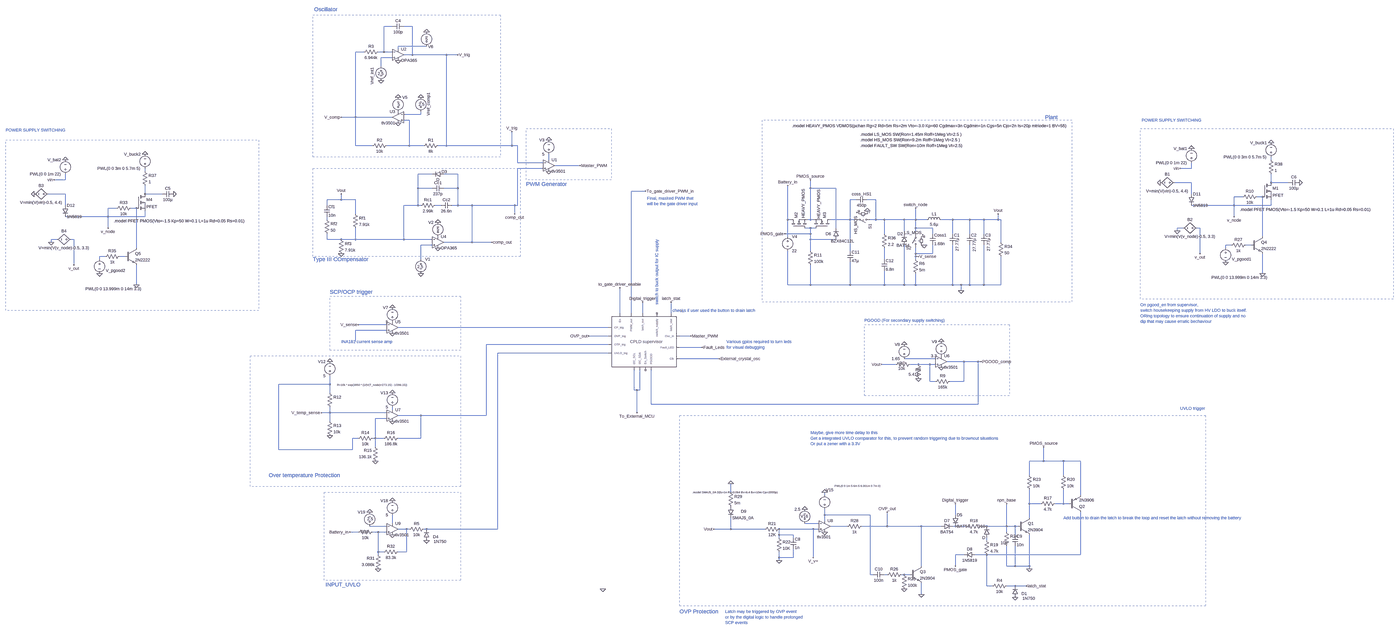
[diagram p0: schematic digital_architecture.asc, whole sheet]
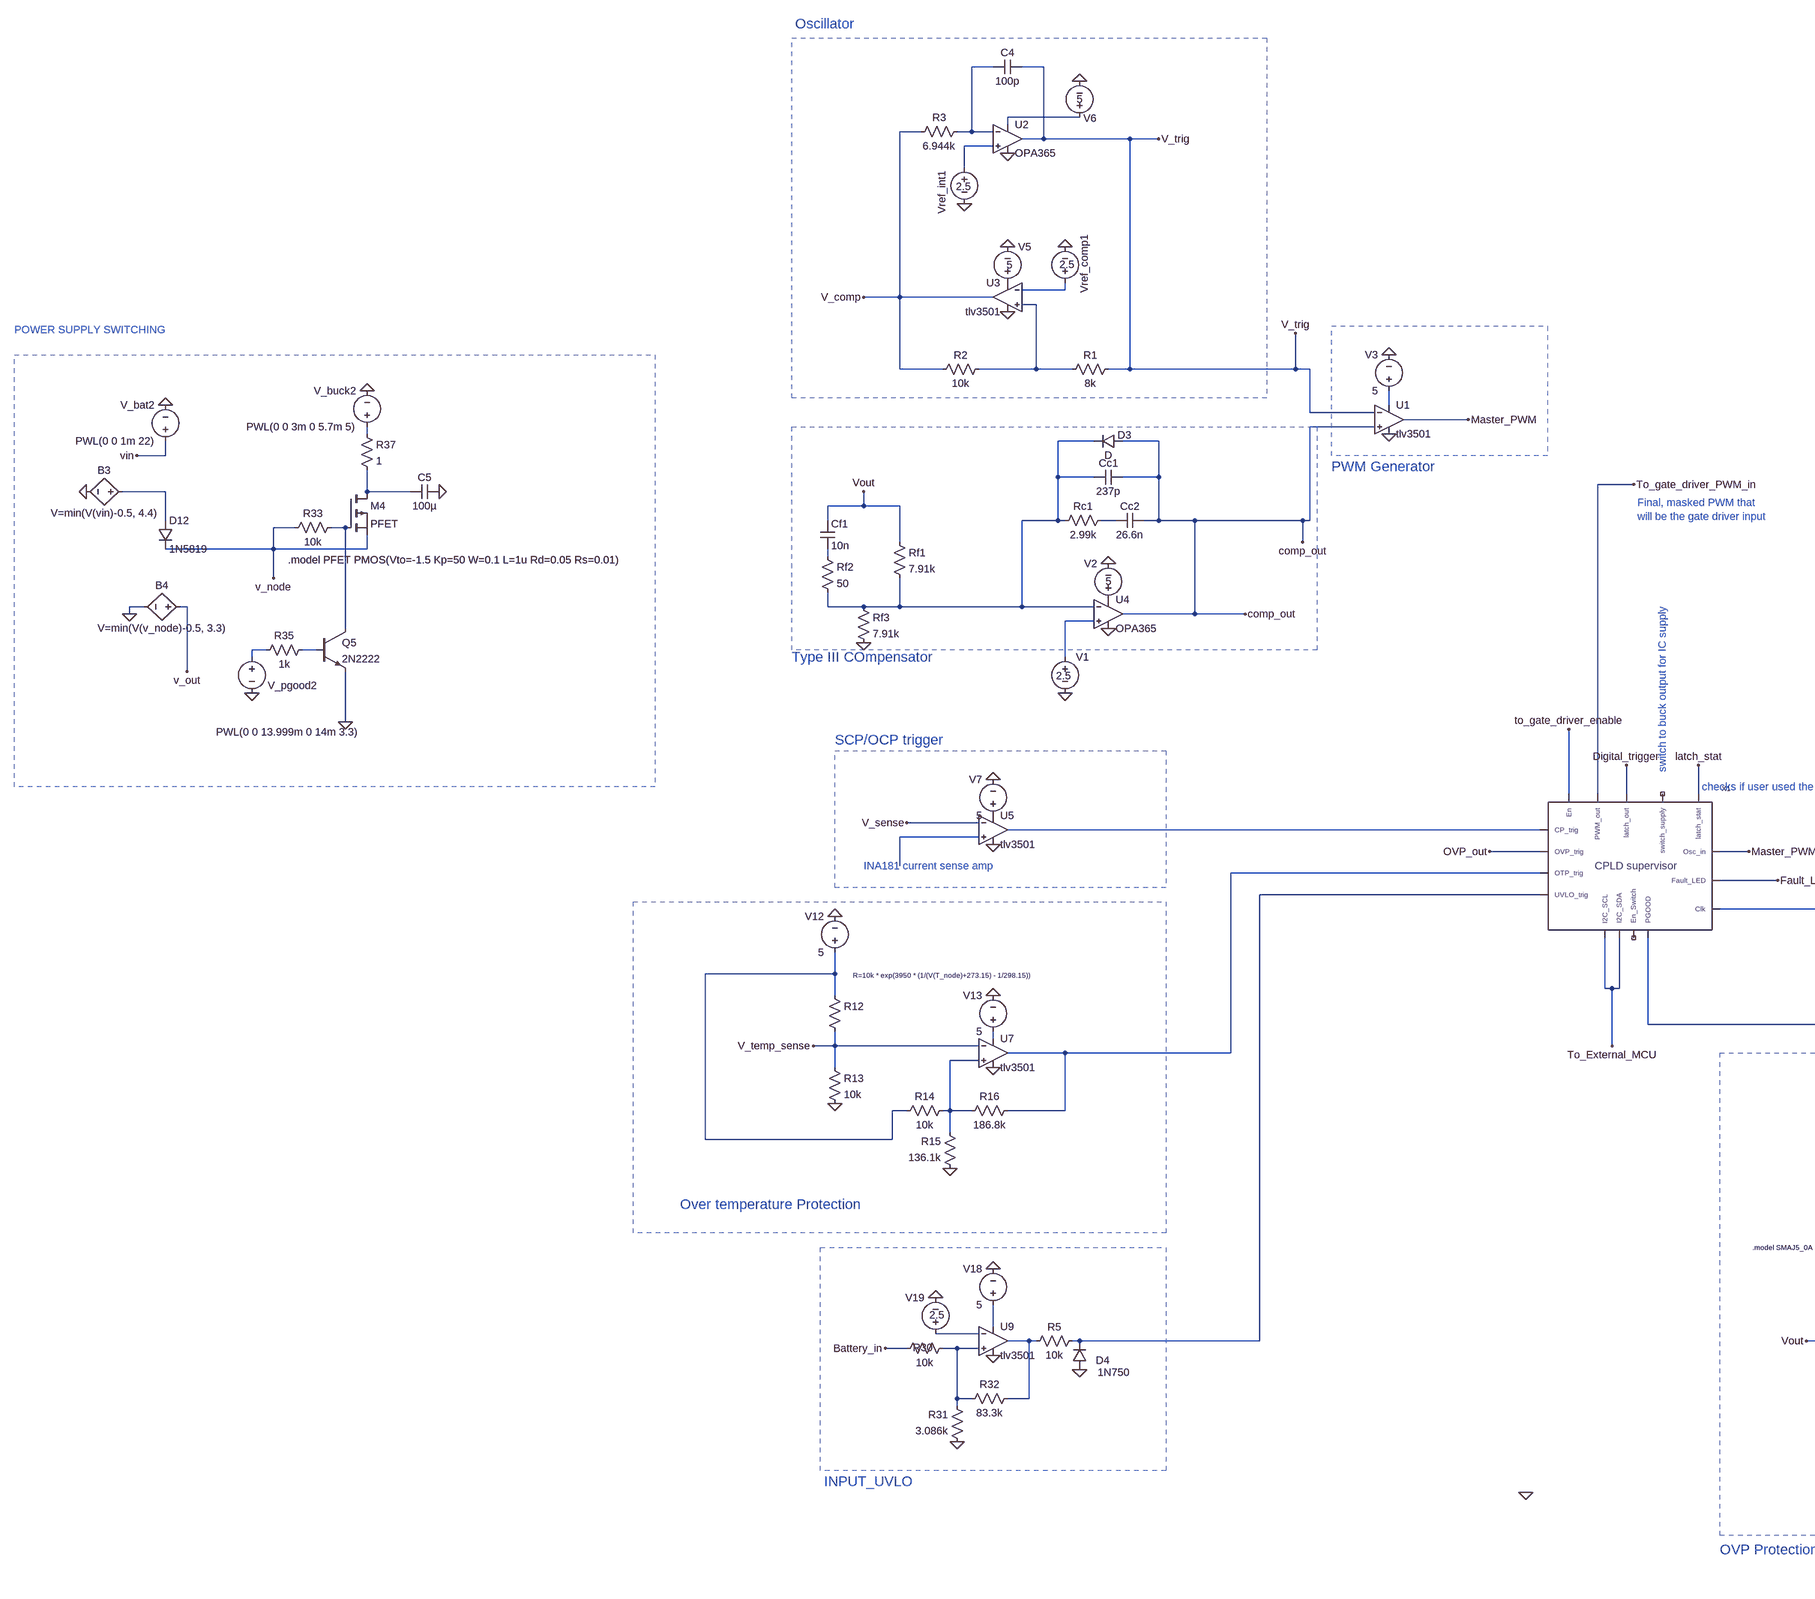
[diagram p1: schematic digital_architecture.asc, part, row 1 of 1, column 1 of 2]
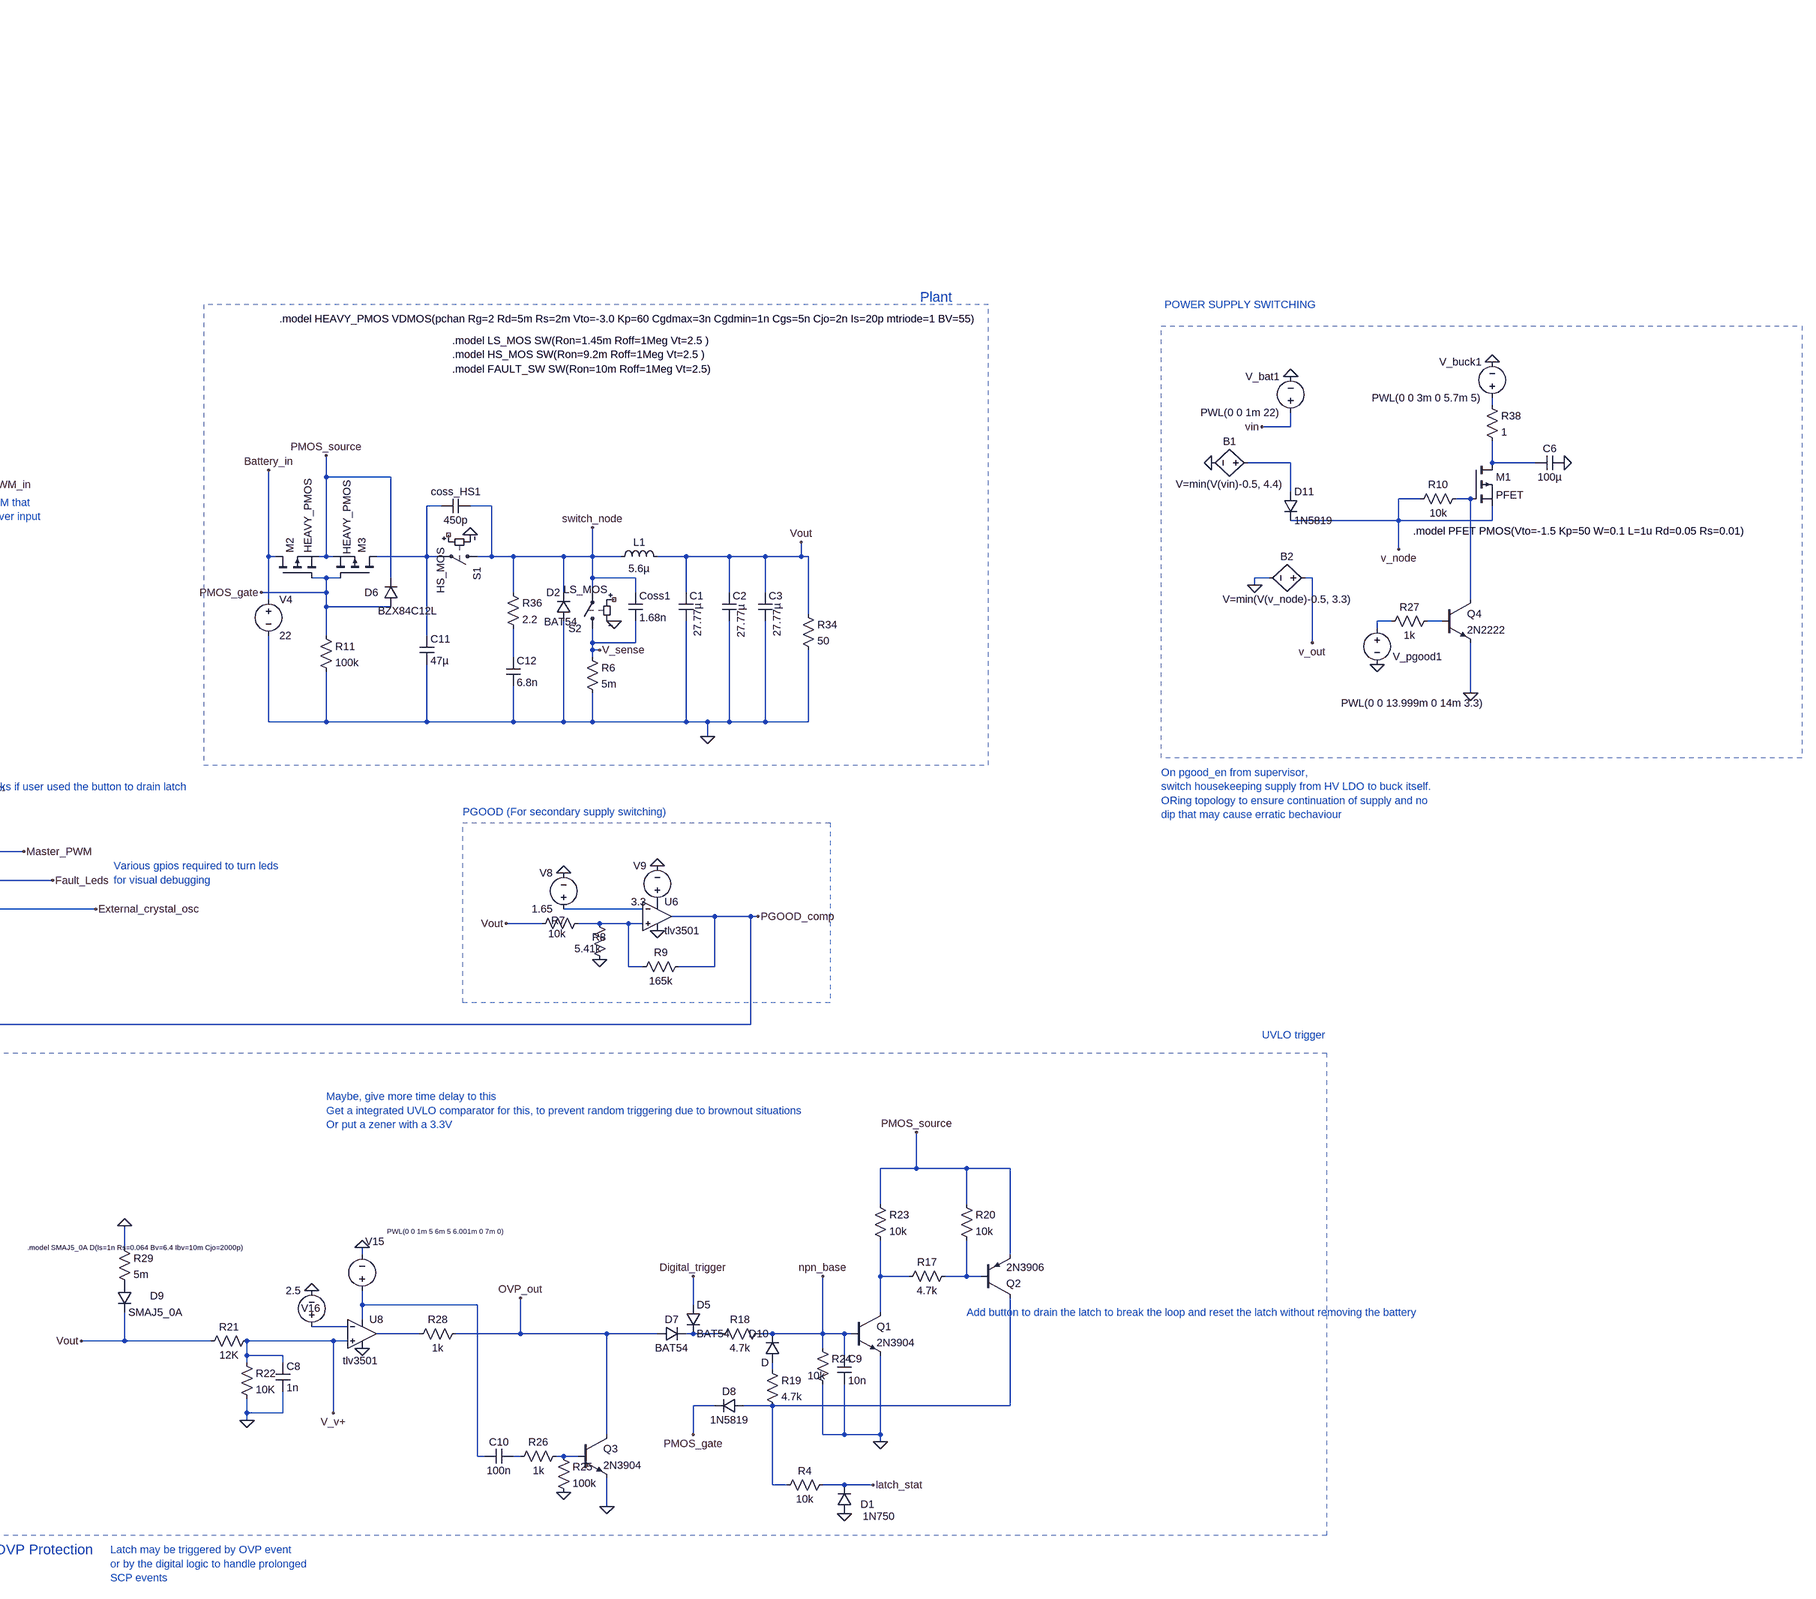
[diagram p2: schematic digital_architecture.asc, part, row 1 of 1, column 2 of 2]
digital_architecture.asc, the LTspice schematic file:
Version 4.1
SHEET 1 8948 4068
WIRE -1408 -1808 -1456 -1808
WIRE -1296 -1808 -1344 -1808
WIRE -1216 -1696 -1376 -1696
WIRE -1376 -1680 -1376 -1696
WIRE -1568 -1664 -1616 -1664
WIRE -1456 -1664 -1456 -1808
WIRE -1456 -1664 -1488 -1664
WIRE -1408 -1664 -1456 -1664
WIRE -1296 -1648 -1296 -1808
WIRE -1296 -1648 -1344 -1648
WIRE -1104 -1648 -1296 -1648
WIRE -1040 -1648 -1104 -1648
WIRE -1408 -1632 -1472 -1632
WIRE -1472 -1584 -1472 -1632
WIRE -1248 -1312 -1248 -1328
WIRE -1248 -1312 -1344 -1312
WIRE -1616 -1296 -1616 -1664
WIRE -1616 -1296 -1696 -1296
WIRE -1408 -1296 -1616 -1296
WIRE -1312 -1280 -1344 -1280
WIRE -1616 -1136 -1616 -1296
WIRE -1520 -1136 -1616 -1136
WIRE -1312 -1136 -1312 -1280
WIRE -1312 -1136 -1440 -1136
WIRE -1232 -1136 -1312 -1136
WIRE -1104 -1136 -1104 -1648
WIRE -1104 -1136 -1152 -1136
WIRE -736 -1136 -736 -1216
WIRE -736 -1136 -1104 -1136
WIRE -704 -1136 -736 -1136
WIRE -528 -1056 -528 -1088
WIRE 3536 -1056 3536 -1072
WIRE -704 -1040 -704 -1136
WIRE -560 -1040 -704 -1040
WIRE -352 -1024 -496 -1024
WIRE -560 -1008 -704 -1008
WIRE 3088 -1008 3088 -1040
WIRE 3088 -1008 3024 -1008
WIRE -2800 -992 -2800 -1008
WIRE -1184 -976 -1264 -976
WIRE -1040 -976 -1120 -976
WIRE -3248 -944 -3248 -976
WIRE -3248 -944 -3312 -944
WIRE 3088 -928 2992 -928
WIRE 3536 -928 3536 -976
WIRE 3632 -928 3536 -928
WIRE -1264 -896 -1264 -976
WIRE -1184 -896 -1264 -896
WIRE -1040 -896 -1040 -976
WIRE -1040 -896 -1120 -896
WIRE 944 -896 944 -944
WIRE 1088 -896 944 -896
WIRE 16 -880 -64 -880
WIRE -3248 -864 -3344 -864
WIRE -2800 -864 -2800 -912
WIRE -2704 -864 -2800 -864
WIRE 3088 -864 3088 -928
WIRE 3376 -848 3328 -848
WIRE 3488 -848 3456 -848
WIRE -1696 -832 -1696 -864
WIRE -1696 -832 -1776 -832
WIRE -1616 -832 -1696 -832
WIRE 1200 -832 1168 -832
WIRE 1312 -832 1264 -832
WIRE -3248 -800 -3248 -864
WIRE -1776 -800 -1776 -832
WIRE -1264 -800 -1264 -896
WIRE -1264 -800 -1344 -800
WIRE -1248 -800 -1264 -800
WIRE -1136 -800 -1168 -800
WIRE -1040 -800 -1040 -896
WIRE -1040 -800 -1072 -800
WIRE -960 -800 -1040 -800
WIRE -720 -800 -960 -800
WIRE -704 -800 -704 -1008
WIRE -704 -800 -720 -800
WIRE 3328 -800 3328 -848
WIRE 3328 -800 3088 -800
WIRE 3536 -800 3536 -832
WIRE 3536 -800 3328 -800
WIRE -2960 -784 -3008 -784
WIRE -2848 -784 -2880 -784
WIRE -1616 -752 -1616 -832
WIRE -720 -752 -720 -800
WIRE -3008 -736 -3008 -784
WIRE -3008 -736 -3248 -736
WIRE -2800 -736 -2800 -768
WIRE -2800 -736 -3008 -736
WIRE 3328 -736 3328 -800
WIRE -1776 -720 -1776 -736
WIRE 816 -720 816 -912
WIRE 832 -720 816 -720
WIRE 944 -720 944 -896
WIRE 944 -720 928 -720
WIRE 960 -720 944 -720
WIRE 1168 -720 1168 -832
WIRE 1168 -720 1056 -720
WIRE 1200 -720 1168 -720
WIRE 1312 -720 1312 -832
WIRE 1312 -720 1280 -720
WIRE 1360 -720 1312 -720
WIRE 1472 -720 1360 -720
WIRE 1536 -720 1536 -784
WIRE 1536 -720 1472 -720
WIRE 1600 -720 1536 -720
WIRE 1744 -720 1680 -720
WIRE 1840 -720 1744 -720
WIRE 1920 -720 1840 -720
WIRE 2000 -720 2000 -752
WIRE 2000 -720 1920 -720
WIRE 2016 -720 2000 -720
WIRE -3008 -672 -3008 -736
WIRE 944 -672 912 -672
WIRE 976 -672 944 -672
WIRE 1088 -672 1088 -896
WIRE 1536 -672 1536 -720
WIRE 1632 -672 1536 -672
WIRE 3040 -672 3008 -672
WIRE 3136 -672 3120 -672
WIRE 3008 -656 3008 -672
WIRE 944 -640 944 -672
WIRE 944 -640 800 -640
WIRE 1360 -640 1360 -720
WIRE 1472 -640 1472 -720
WIRE 1536 -640 1536 -672
WIRE 1632 -640 1632 -672
WIRE 1744 -640 1744 -720
WIRE 1840 -640 1840 -720
WIRE 1920 -640 1920 -720
WIRE 816 -624 816 -720
WIRE 3488 -624 3488 -848
WIRE -3296 -608 -3328 -608
WIRE -3200 -608 -3216 -608
WIRE -1776 -608 -1776 -640
WIRE -1696 -608 -1776 -608
WIRE -1616 -608 -1616 -672
WIRE -1616 -608 -1696 -608
WIRE -1344 -608 -1344 -800
WIRE -1344 -608 -1616 -608
WIRE -1184 -608 -1344 -608
WIRE 944 -608 944 -640
WIRE 1088 -608 944 -608
WIRE -3328 -592 -3328 -608
WIRE -960 -592 -960 -800
WIRE -960 -592 -1120 -592
WIRE -848 -592 -960 -592
WIRE 2016 -592 2016 -720
WIRE -1184 -576 -1248 -576
WIRE 3312 -576 3280 -576
WIRE 3424 -576 3392 -576
WIRE -2848 -560 -2848 -784
WIRE 3280 -560 3280 -576
WIRE 944 -544 944 -608
WIRE 1168 -544 1168 -720
WIRE 1536 -528 1536 -560
WIRE 1632 -528 1632 -576
WIRE 1632 -528 1536 -528
WIRE 3136 -528 3136 -672
WIRE -3024 -512 -3056 -512
WIRE -2912 -512 -2944 -512
WIRE 1536 -512 1536 -528
WIRE 1552 -512 1536 -512
WIRE -3056 -496 -3056 -512
WIRE -1248 -496 -1248 -576
WIRE 1360 -496 1360 -560
WIRE 1536 -496 1536 -512
WIRE -3200 -464 -3200 -608
WIRE 3488 -416 3488 -528
WIRE -2848 -352 -2848 -464
WIRE 816 -352 816 -544
WIRE 944 -352 944 -464
WIRE 944 -352 816 -352
WIRE 1168 -352 1168 -480
WIRE 1168 -352 944 -352
WIRE 1360 -352 1360 -432
WIRE 1360 -352 1168 -352
WIRE 1472 -352 1472 -576
WIRE 1472 -352 1360 -352
WIRE 1536 -352 1536 -416
WIRE 1536 -352 1472 -352
WIRE 1744 -352 1744 -576
WIRE 1744 -352 1536 -352
WIRE 1792 -352 1744 -352
WIRE 1840 -352 1840 -576
WIRE 1840 -352 1792 -352
WIRE 1920 -352 1920 -576
WIRE 1920 -352 1840 -352
WIRE 2016 -352 2016 -512
WIRE 2016 -352 1920 -352
WIRE 1792 -320 1792 -352
WIRE -128 -192 -128 -336
WIRE -64 -192 -64 -880
WIRE 0 -192 0 -256
WIRE 160 -192 160 -256
WIRE -1440 -128 -1600 -128
WIRE -192 -112 -1376 -112
WIRE -1440 -96 -1616 -96
WIRE -192 -64 -304 -64
WIRE 272 -64 208 -64
WIRE -1616 -32 -1616 -96
WIRE -192 -16 -880 -16
WIRE 336 0 208 0
WIRE -192 32 -816 32
WIRE 432 64 208 64
WIRE 1648 64 1472 64
WIRE 1808 80 1712 80
WIRE 1888 80 1808 80
WIRE 1904 80 1888 80
WIRE 1424 96 1344 96
WIRE 1552 96 1504 96
WIRE 1616 96 1552 96
WIRE 1648 96 1616 96
WIRE 1616 192 1616 96
WIRE 1648 192 1616 192
WIRE 1808 192 1808 80
WIRE 1808 192 1728 192
WIRE -1760 208 -1760 160
WIRE -1760 208 -2048 208
WIRE -48 240 -48 128
WIRE -32 240 -48 240
WIRE -16 240 -16 128
WIRE -16 240 -32 240
WIRE -1760 256 -1760 208
WIRE 48 320 48 128
WIRE 1888 320 1888 80
WIRE 1888 320 48 320
WIRE -1408 352 -1408 336
WIRE -1760 368 -1760 336
WIRE -1760 368 -1808 368
WIRE -1440 368 -1760 368
WIRE -32 368 -32 240
WIRE -1248 384 -1376 384
WIRE -880 384 -880 -16
WIRE -880 384 -1248 384
WIRE -1440 400 -1504 400
WIRE -1760 416 -1760 368
WIRE -1600 512 -1632 512
WIRE -1504 512 -1504 400
WIRE -1504 512 -1520 512
WIRE -1456 512 -1504 512
WIRE -1248 512 -1248 384
WIRE -1248 512 -1376 512
WIRE -1504 560 -1504 512
WIRE -2048 576 -2048 208
WIRE -1632 576 -1632 512
WIRE -1632 576 -2048 576
WIRE 2256 640 2256 560
WIRE 2256 640 2176 640
WIRE 2368 640 2256 640
WIRE 2464 640 2368 640
WIRE 2176 720 2176 640
WIRE 2368 720 2368 640
WIRE 496 816 496 768
WIRE 1024 832 1024 816
WIRE 2464 832 2464 640
WIRE 2176 880 2176 800
WIRE 2240 880 2176 880
WIRE 2368 880 2368 800
WIRE 2368 880 2320 880
WIRE 2400 880 2368 880
WIRE 1024 944 1024 912
WIRE 1280 944 1024 944
WIRE 1760 944 1760 880
WIRE 2176 960 2176 880
WIRE 1024 976 1024 944
WIRE -1408 992 -1408 944
WIRE 992 992 912 992
WIRE -1440 1008 -1536 1008
WIRE 1152 1008 1056 1008
WIRE 1376 1008 1376 928
WIRE 1376 1008 1232 1008
WIRE 1568 1008 1376 1008
WIRE 1680 1008 1568 1008
WIRE 1760 1008 1744 1008
WIRE 1824 1008 1760 1008
WIRE 1936 1008 1904 1008
WIRE 2048 1008 2048 880
WIRE 2048 1008 1936 1008
WIRE 2096 1008 2048 1008
WIRE 2112 1008 2096 1008
WIRE -1328 1024 -1376 1024
WIRE -1312 1024 -1328 1024
WIRE -1216 1024 -1232 1024
WIRE -816 1024 -816 32
WIRE -816 1024 -1216 1024
WIRE 496 1024 496 960
WIRE 496 1024 400 1024
WIRE 688 1024 496 1024
WIRE 960 1024 768 1024
WIRE 992 1024 960 1024
WIRE -1600 1040 -1648 1040
WIRE -1488 1040 -1520 1040
WIRE -1440 1040 -1488 1040
WIRE 2048 1040 2048 1008
WIRE 768 1056 768 1024
WIRE 848 1056 768 1056
WIRE 2096 1056 2096 1008
WIRE 768 1072 768 1056
WIRE 848 1072 848 1056
WIRE 1936 1088 1936 1072
WIRE -1488 1152 -1488 1040
WIRE -1456 1152 -1488 1152
WIRE -1328 1152 -1328 1024
WIRE -1328 1152 -1376 1152
WIRE -1488 1168 -1488 1152
WIRE 1808 1168 1760 1168
WIRE 1936 1168 1872 1168
WIRE 2464 1168 2464 928
WIRE 2464 1168 1936 1168
WIRE 768 1184 768 1152
WIRE 848 1184 848 1136
WIRE 848 1184 768 1184
WIRE 960 1184 960 1024
WIRE 768 1200 768 1184
WIRE 1568 1232 1568 1008
WIRE 1760 1232 1760 1168
WIRE 2048 1232 2048 1120
WIRE 2096 1232 2096 1120
WIRE 2096 1232 2048 1232
WIRE 2176 1232 2176 1056
WIRE 2176 1232 2096 1232
WIRE 2176 1248 2176 1232
WIRE 1280 1280 1280 944
WIRE 1296 1280 1280 1280
WIRE 1376 1280 1360 1280
WIRE 1472 1280 1456 1280
WIRE 1504 1280 1472 1280
WIRE 1936 1344 1936 1168
WIRE 1968 1344 1936 1344
WIRE 2096 1344 2048 1344
WIRE 2160 1344 2096 1344
WIRE 1568 1392 1568 1328
FLAG 1792 -320 0
FLAG -1696 -528 0
FLAG -1152 -704 0
FLAG -1152 -560 0
FLAG -848 -592 comp_out
FLAG 2000 -752 Vout
FLAG -528 -992 0
FLAG -720 -752 comp_out
FLAG -528 -1168 0
FLAG 1264 -768 0
FLAG -1376 -1408 0
FLAG -1216 -1776 0
FLAG -1376 -1264 0
FLAG -1248 -1408 0
FLAG -1472 -1504 0
FLAG -1040 -1648 V_trig
FLAG -1696 -1296 V_comp
FLAG -1376 -1616 0
FLAG -736 -1216 V_trig
FLAG -1696 -864 Vout
FLAG -1248 -416 0
FLAG 1584 -576 0
FLAG 1552 -512 V_sense
FLAG -1600 -128 V_sense
FLAG -352 -1024 Master_PWM
FLAG -1408 -224 0
FLAG -1408 -80 0
FLAG -224 1360 0
FLAG -1760 496 0
FLAG -1808 368 V_temp_sense
FLAG -1408 256 0
FLAG -1408 416 0
FLAG -1504 640 0
FLAG 800 -640 PMOS_gate
FLAG 944 -944 PMOS_source
FLAG 1024 816 0
FLAG 1024 1040 0
FLAG 2176 1248 0
FLAG 912 912 0
FLAG 960 1184 V_v+
FLAG 768 1200 0
FLAG 1568 1392 0
FLAG 1472 1360 0
FLAG 2048 880 npn_base
FLAG 400 1024 Vout
FLAG 2256 560 PMOS_source
FLAG 1760 1232 PMOS_gate
FLAG 496 768 0
FLAG 816 -912 Battery_in
FLAG -1408 864 0
FLAG -1408 1056 0
FLAG -1488 1248 0
FLAG -1536 928 0
FLAG 1536 -784 switch_node
FLAG 2160 1344 latch_stat
FLAG 2096 1408 0
FLAG -304 -64 OVP_out
FLAG -1760 80 0
FLAG -1648 1040 Battery_in
FLAG -1216 1088 0
FLAG -32 368 To_External_MCU
FLAG 432 64 External_crystal_osc
FLAG 272 -64 Master_PWM
FLAG 16 -880 To_gate_driver_PWM_in
FLAG 336 0 Fault_Leds
FLAG -128 -336 to_gate_driver_enable
FLAG 1760 880 Digital_trigger
FLAG 0 -256 Digital_trigger
FLAG 160 -256 latch_stat
FLAG 1376 928 OVP_out
FLAG 1472 -16 0
FLAG 1680 112 0
FLAG 1344 96 Vout
FLAG 1552 176 0
FLAG 1680 -32 0
FLAG 1904 80 PGOOD_comp
FLAG -3312 -944 vin
FLAG -3248 -1056 0
FLAG -3424 -864 0
FLAG -3056 -416 0
FLAG -2800 -1088 0
FLAG -2848 -352 0
FLAG -3008 -672 v_node
FLAG -3328 -592 0
FLAG -3200 -464 v_out
FLAG -2640 -864 0
FLAG 3024 -1008 vin
FLAG 3088 -1120 0
FLAG 2912 -928 0
FLAG 3280 -480 0
FLAG 3536 -1152 0
FLAG 3488 -416 0
FLAG 3328 -736 v_node
FLAG 3008 -656 0
FLAG 3136 -528 v_out
FLAG 3696 -928 0
SYMBOL cap 1728 -640 R0
WINDOW 3 42 24 VRight 2
SYMATTR Value 27.77µ
SYMATTR InstName C1
SYMATTR SpiceLine V=25 Rser=2.94m Lser=0.6n
SYMBOL ind 1584 -704 R270
WINDOW 0 32 56 VTop 2
WINDOW 3 5 56 VBottom 2
SYMATTR InstName L1
SYMATTR Value 5.6µ
SYMATTR SpiceLine Rser=1m
SYMBOL voltage -1248 -512 R0
WINDOW 123 0 0 Left 0
WINDOW 39 0 0 Left 0
WINDOW 3 -20 57 Left 2
SYMATTR Value 2.5
SYMATTR InstName V1
SYMBOL res -1632 -768 R0
SYMATTR InstName Rf1
SYMATTR Value 7.91k
SYMBOL res -1792 -736 R0
SYMATTR InstName Rf2
SYMATTR Value 50
SYMBOL cap -1792 -800 R0
SYMATTR InstName Cf1
SYMATTR Value 10n
SYMBOL res -1152 -816 R90
WINDOW 0 0 56 VBottom 2
WINDOW 3 32 56 VTop 2
SYMATTR InstName Rc1
SYMATTR Value 2.99k
SYMBOL cap -1120 -912 R90
WINDOW 0 0 32 VBottom 2
WINDOW 3 32 32 VTop 2
SYMATTR InstName Cc1
SYMATTR Value 237p
SYMBOL res -1712 -624 R0
SYMATTR InstName Rf3
SYMATTR Value 7.91k
SYMBOL voltage -1152 -608 R180
WINDOW 0 24 96 Left 2
WINDOW 3 -7 57 Left 2
WINDOW 123 0 0 Left 0
WINDOW 39 0 0 Left 0
SYMATTR InstName V2
SYMATTR Value 5
SYMBOL cap -1072 -816 R90
WINDOW 0 0 32 VBottom 2
WINDOW 3 32 32 VTop 2
SYMATTR InstName Cc2
SYMATTR Value 26.6n
SYMBOL cap 1824 -640 R0
WINDOW 3 43 26 VRight 2
SYMATTR Value 27.77µ
SYMATTR InstName C2
SYMATTR SpiceLine V=25 Rser=2.94m Lser=0.6n
SYMBOL cap 1904 -640 R0
WINDOW 3 43 24 VRight 2
SYMATTR Value 27.77µ
SYMATTR InstName C3
SYMATTR SpiceLine V=25 Rser=2.94m Lser=0.6n
SYMBOL OpAmps\\opamp2 -528 -1088 R0
SYMATTR InstName U1
SYMATTR Value tlv3501
SYMBOL voltage -528 -1072 R180
WINDOW 0 24 96 Left 2
WINDOW 3 24 16 Left 2
WINDOW 123 0 0 Left 0
WINDOW 39 0 0 Left 0
SYMATTR InstName V3
SYMATTR Value 5
SYMBOL sw 1296 -720 R90
WINDOW 3 -19 97 Left 2
SYMATTR Value HS_MOS
SYMATTR InstName S1
SYMBOL voltage 816 -640 R0
SYMATTR InstName V4
SYMATTR Value 22
SYMBOL voltage -1376 -1312 M180
WINDOW 0 24 96 Left 2
WINDOW 3 -2 56 Left 2
WINDOW 123 0 0 Left 0
WINDOW 39 0 0 Left 0
SYMATTR InstName V5
SYMATTR Value 5
SYMBOL voltage -1216 -1680 R180
WINDOW 0 -38 14 Left 2
WINDOW 3 -7 56 Left 2
WINDOW 123 0 0 Left 0
WINDOW 39 0 0 Left 0
SYMATTR InstName V6
SYMATTR Value 5
SYMBOL res -1136 -1152 R90
WINDOW 0 0 56 VBottom 2
WINDOW 3 32 56 VTop 2
SYMATTR InstName R1
SYMATTR Value 8k
SYMBOL res -1424 -1152 R90
WINDOW 0 0 56 VBottom 2
WINDOW 3 32 56 VTop 2
SYMATTR InstName R2
SYMATTR Value 10k
SYMBOL res -1472 -1680 R90
WINDOW 0 0 56 VBottom 2
WINDOW 3 32 56 VTop 2
SYMATTR InstName R3
SYMATTR Value 6.944k
SYMBOL cap -1344 -1824 R90
WINDOW 0 0 32 VBottom 2
WINDOW 3 32 32 VTop 2
SYMATTR InstName C4
SYMATTR Value 100p
SYMBOL voltage -1248 -1312 R180
WINDOW 0 -43 -7 VRight 2
WINDOW 3 -21 57 Left 2
WINDOW 123 0 0 Left 0
WINDOW 39 0 0 Left 0
SYMATTR InstName Vref_comp1
SYMATTR Value 2.5
SYMBOL voltage -1472 -1600 R0
WINDOW 0 -50 22 VRight 2
WINDOW 3 -19 58 Left 2
WINDOW 123 0 0 Left 0
WINDOW 39 0 0 Left 0
SYMATTR InstName Vref_int1
SYMATTR Value 2.5
SYMBOL OpAmps\\opamp2 -1376 -1712 R0
SYMATTR InstName U2
SYMATTR Value OPA365
SYMBOL OpAmps\\opamp2 -1376 -1360 M0
SYMATTR InstName U3
SYMATTR Value tlv3501
SYMBOL OpAmps\\opamp2 -1152 -656 R0
SYMATTR InstName U4
SYMATTR Value OPA365
SYMBOL sw 1536 -544 R180
WINDOW 3 -33 102 Left 2
SYMATTR Value LS_MOS
SYMATTR InstName S2
SYMBOL diode 1488 -576 R180
WINDOW 0 24 64 Left 2
WINDOW 3 -14 -1 Left 2
SYMATTR InstName D2
SYMATTR Value BAT54
SYMBOL diode -1120 -992 R90
WINDOW 0 18 -4 VBottom 2
WINDOW 3 32 32 VTop 2
SYMATTR InstName D3
SYMBOL res 1520 -512 R0
SYMATTR InstName R6
SYMATTR Value 5m
SYMBOL OpAmps\\opamp2 -1408 -176 R0
SYMATTR InstName U5
SYMATTR Value tlv3501
SYMBOL voltage -1408 -128 R180
WINDOW 0 24 96 Left 2
WINDOW 3 24 16 Left 2
WINDOW 123 0 0 Left 0
WINDOW 39 0 0 Left 0
SYMATTR InstName V7
SYMATTR Value 5
SYMBOL pmos 832 -672 R270
SYMATTR InstName M2
SYMATTR Value HEAVY_PMOS
SYMBOL res 928 -560 R0
SYMATTR InstName R11
SYMATTR Value 100k
SYMBOL diode 1104 -608 R180
WINDOW 0 44 32 Left 2
WINDOW 3 -87 -9 Left 2
SYMATTR InstName D6
SYMATTR Value BZX84C12L
SYMBOL res -1776 240 R0
WINDOW 3 56 -29 Left 1
SYMATTR Value R=10k * exp(3950 * (1/(V(T_node)+273.15) - 1/298.15))
SYMATTR InstName R12
SYMBOL res -1776 400 R0
SYMATTR InstName R13
SYMATTR Value 10k
SYMBOL voltage -1760 176 R180
WINDOW 0 24 96 Left 2
WINDOW 3 24 16 Left 2
WINDOW 123 0 0 Left 0
WINDOW 39 0 0 Left 0
SYMATTR InstName V12
SYMATTR Value 5
SYMBOL OpAmps\\opamp2 -1408 320 R0
SYMATTR InstName U7
SYMATTR Value tlv3501
SYMBOL voltage -1408 352 R180
WINDOW 0 24 96 Left 2
WINDOW 3 24 16 Left 2
WINDOW 123 0 0 Left 0
WINDOW 39 0 0 Left 0
SYMATTR InstName V13
SYMATTR Value 5
SYMBOL res -1504 496 R90
WINDOW 0 0 56 VBottom 2
WINDOW 3 32 56 VTop 2
SYMATTR InstName R14
SYMATTR Value 10k
SYMBOL res -1488 656 R180
WINDOW 0 36 76 Left 2
WINDOW 3 36 40 Left 2
SYMATTR InstName R15
SYMATTR Value 136.1k
SYMBOL res -1360 496 R90
WINDOW 0 0 56 VBottom 2
WINDOW 3 32 56 VTop 2
SYMATTR InstName R16
SYMATTR Value 186.8k
SYMBOL OpAmps\\opamp2 1024 944 R0
WINDOW 3 -43 124 Left 2
SYMATTR Value tlv3501
SYMATTR InstName U8
SYMBOL voltage 1024 928 R180
WINDOW 0 -50 125 Left 2
WINDOW 3 -317 148 Left 1
SYMATTR InstName V15
SYMATTR Value PWL(0 0 1m 5 6m 5 6.001m 0 7m 0)
SYMBOL voltage 912 1008 R180
WINDOW 0 -19 57 Left 2
WINDOW 123 0 0 Left 0
WINDOW 39 0 0 Left 0
SYMATTR InstName V16
SYMATTR Value 2.5
SYMBOL npn 2112 960 R0
SYMATTR InstName Q1
SYMATTR Value 2N3904
SYMBOL pnp 2400 928 M180
SYMATTR InstName Q2
SYMATTR Value 2N3906
SYMBOL res 2336 864 R90
WINDOW 0 0 56 VBottom 2
WINDOW 3 32 56 VTop 2
SYMATTR InstName R17
SYMATTR Value 4.7k
SYMBOL res 1920 992 R90
WINDOW 0 0 56 VBottom 2
WINDOW 3 32 56 VTop 2
SYMATTR InstName R18
SYMATTR Value 4.7k
SYMBOL diode 1680 1024 R270
WINDOW 0 32 32 VTop 2
WINDOW 3 0 32 VBottom 2
SYMATTR InstName D7
SYMATTR Value BAT54
SYMBOL res 1920 1072 R0
SYMATTR InstName R19
SYMATTR Value 4.7k
SYMBOL diode 1872 1152 R90
WINDOW 0 0 32 VBottom 2
WINDOW 3 32 32 VTop 2
SYMATTR InstName D8
SYMATTR Value 1N5819
SYMBOL res 2352 704 R0
SYMATTR InstName R20
SYMATTR Value 10k
SYMBOL diode 480 896 R0
WINDOW 0 73 28 Left 2
SYMATTR InstName D9
SYMATTR Value SMAJ5_0A
SYMBOL res 784 1008 R90
WINDOW 0 0 56 VBottom 2
WINDOW 3 32 56 VTop 2
SYMATTR InstName R21
SYMATTR Value 12K
SYMBOL res 752 1056 R0
SYMATTR InstName R22
SYMATTR Value 10K
SYMBOL cap 832 1072 R0
SYMATTR InstName C8
SYMATTR Value 1n
SYMBOL cap 2080 1056 R0
SYMATTR InstName C9
SYMATTR Value 10n
SYMBOL res 2160 704 R0
SYMATTR InstName R23
SYMATTR Value 10k
SYMBOL diode 1952 1072 R180
WINDOW 0 24 64 Left 2
WINDOW 3 24 0 Left 2
SYMATTR InstName D10
SYMBOL res 2032 1024 R0
WINDOW 3 -18 77 Left 2
SYMATTR Value 10k
SYMATTR InstName R24
SYMBOL npn 1504 1232 R0
SYMATTR InstName Q3
SYMATTR Value 2N3904
SYMBOL cap 1360 1264 R90
WINDOW 0 0 32 VBottom 2
WINDOW 3 32 32 VTop 2
SYMATTR InstName C10
SYMATTR Value 100n
SYMATTR SpiceLine Rser=0.1
SYMBOL res 1456 1264 R0
SYMATTR InstName R25
SYMATTR Value 100k
SYMBOL res 1472 1264 R90
WINDOW 0 0 56 VBottom 2
WINDOW 3 32 56 VTop 2
SYMATTR InstName R26
SYMATTR Value 1k
SYMBOL res 1248 992 R90
WINDOW 0 0 56 VBottom 2
WINDOW 3 32 56 VTop 2
SYMATTR InstName R28
SYMATTR Value 1k
SYMBOL pmos 1056 -672 M270
WINDOW 3 53 65 Left 2
SYMATTR Value HEAVY_PMOS
SYMATTR InstName M3
SYMBOL res 480 800 R0
SYMATTR InstName R29
SYMATTR Value 5m
SYMBOL cap 1152 -544 R0
SYMATTR InstName C11
SYMATTR Value 47µ
SYMATTR SpiceLine Rser=0.05
SYMBOL OpAmps\\opamp2 -1408 960 R0
SYMATTR InstName U9
SYMATTR Value tlv3501
SYMBOL voltage -1408 960 R180
WINDOW 0 24 96 Left 2
WINDOW 3 24 16 Left 2
WINDOW 123 0 0 Left 0
WINDOW 39 0 0 Left 0
SYMATTR InstName V18
SYMATTR Value 5
SYMBOL res -1504 1024 R90
WINDOW 0 30 60 VBottom 2
WINDOW 3 32 56 VTop 2
SYMATTR InstName R30
SYMATTR Value 10k
SYMBOL res -1472 1264 R180
WINDOW 0 36 76 Left 2
WINDOW 3 36 40 Left 2
SYMATTR InstName R31
SYMATTR Value 3.086k
SYMBOL res -1472 1168 R270
WINDOW 0 32 56 VTop 2
WINDOW 3 0 56 VBottom 2
SYMATTR InstName R32
SYMATTR Value 83.3k
SYMBOL voltage -1536 1024 R180
WINDOW 0 24 96 Left 2
WINDOW 3 -20 58 Left 2
WINDOW 123 0 0 Left 0
WINDOW 39 0 0 Left 0
SYMATTR InstName V19
SYMATTR Value 2.5
SYMBOL res 2000 -608 R0
SYMATTR InstName R34
SYMATTR Value 50
SYMBOL cap 1616 -640 R0
SYMATTR InstName Coss1
SYMATTR Value 1.68n
SYMBOL cap 1264 -848 R90
WINDOW 0 0 32 VBottom 2
WINDOW 3 32 32 VTop 2
SYMATTR InstName coss_HS1
SYMATTR Value 450p
SYMBOL cap 1344 -496 R0
SYMATTR InstName C12
SYMATTR Value 6.8n
SYMBOL res 1344 -656 R0
SYMATTR InstName R36
SYMATTR Value 2.2
SYMBOL CPLD_super 48 -16 R0
SYMATTR InstName X1
SYMBOL res 2064 1328 R90
WINDOW 0 0 56 VBottom 2
WINDOW 3 32 56 VTop 2
SYMATTR InstName R4
SYMATTR Value 10k
SYMBOL diode 2112 1408 R180
WINDOW 0 -51 21 Left 2
WINDOW 3 -96 -6 Left 2
SYMATTR InstName D1
SYMATTR Value 1N750
SYMBOL diode -1200 1088 R180
WINDOW 0 -51 21 Left 2
WINDOW 3 -96 -6 Left 2
SYMATTR InstName D4
SYMATTR Value 1N750
SYMBOL res -1216 1008 R90
WINDOW 0 0 56 VBottom 2
WINDOW 3 32 56 VTop 2
SYMATTR InstName R5
SYMATTR Value 10k
SYMBOL diode 1744 944 R0
SYMATTR InstName D5
SYMATTR Value BAT54
SYMBOL OpAmps\\opamp2 1680 16 R0
SYMATTR InstName U6
SYMATTR Value tlv3501
SYMBOL voltage 1472 80 R180
WINDOW 0 24 96 Left 2
WINDOW 3 24 16 Left 2
WINDOW 123 0 0 Left 0
WINDOW 39 0 0 Left 0
SYMATTR InstName V8
SYMATTR Value 1.65
SYMBOL res 1520 80 R90
WINDOW 0 25 60 VBottom 2
WINDOW 3 23 63 VTop 2
SYMATTR InstName R7
SYMATTR Value 10k
SYMBOL res 1568 192 R180
WINDOW 0 2 66 Left 2
WINDOW 3 13 40 Left 2
SYMATTR InstName R8
SYMATTR Value 5.41k
SYMBOL res 1744 176 R90
WINDOW 0 0 56 VBottom 2
WINDOW 3 32 56 VTop 2
SYMATTR InstName R9
SYMATTR Value 165k
SYMBOL voltage 1680 64 R180
WINDOW 0 24 96 Left 2
WINDOW 3 24 16 Left 2
WINDOW 123 0 0 Left 0
WINDOW 39 0 0 Left 0
SYMATTR InstName V9
SYMATTR Value 3.3
SYMBOL pmos -2848 -864 R0
SYMATTR InstName M4
SYMATTR Value PFET
SYMBOL diode -3264 -800 R0
SYMATTR InstName D12
SYMATTR Value 1N5819
SYMBOL voltage -3248 -960 R180
WINDOW 0 24 96 Left 2
WINDOW 3 24 16 Left 2
WINDOW 123 0 0 Left 0
WINDOW 39 0 0 Left 0
SYMATTR InstName V_bat2
SYMATTR Value PWL(0 0 1m 22)
SYMBOL voltage -2800 -992 R180
WINDOW 0 24 96 Left 2
WINDOW 3 24 16 Left 2
WINDOW 123 0 0 Left 0
WINDOW 39 0 0 Left 0
SYMATTR InstName V_buck2
SYMATTR Value PWL(0 0 3m 0 5.7m 5)
SYMBOL voltage -3056 -512 R0
WINDOW 0 35 79 Left 2
WINDOW 3 -80 182 Left 2
WINDOW 123 0 0 Left 0
WINDOW 39 0 0 Left 0
SYMATTR InstName V_pgood2
SYMATTR Value PWL(0 0 13.999m 0 14m 3.3)
SYMBOL bv -3328 -864 R90
WINDOW 0 -32 56 VBottom 2
WINDOW 3 32 56 VTop 2
SYMATTR InstName B3
SYMATTR Value V=min(V(vin)-0.5, 4.4)
SYMBOL res -2864 -800 R90
WINDOW 0 0 56 VBottom 2
WINDOW 3 32 56 VTop 2
SYMATTR InstName R33
SYMATTR Value 10k
SYMBOL npn -2912 -560 R0
SYMATTR InstName Q5
SYMATTR Value 2N2222
SYMBOL res -2928 -528 R90
WINDOW 0 0 56 VBottom 2
WINDOW 3 32 56 VTop 2
SYMATTR InstName R35
SYMATTR Value 1k
SYMBOL bv -3200 -608 R90
WINDOW 0 -32 56 VBottom 2
WINDOW 3 32 56 VTop 2
SYMATTR InstName B4
SYMATTR Value V=min(V(v_node)-0.5, 3.3)
SYMBOL res -2816 -1008 R0
SYMATTR InstName R37
SYMATTR Value 1
SYMBOL cap -2640 -880 R90
WINDOW 0 0 32 VBottom 2
WINDOW 3 32 32 VTop 2
SYMATTR InstName C5
SYMATTR Value 100µ
SYMBOL pmos 3488 -928 R0
SYMATTR InstName M1
SYMATTR Value PFET
SYMBOL diode 3072 -864 R0
SYMATTR InstName D11
SYMATTR Value 1N5819
SYMBOL voltage 3088 -1024 R180
WINDOW 0 24 96 Left 2
WINDOW 3 24 16 Left 2
WINDOW 123 0 0 Left 0
WINDOW 39 0 0 Left 0
SYMATTR InstName V_bat1
SYMATTR Value PWL(0 0 1m 22)
SYMBOL voltage 3536 -1056 R180
WINDOW 0 24 96 Left 2
WINDOW 3 24 16 Left 2
WINDOW 123 0 0 Left 0
WINDOW 39 0 0 Left 0
SYMATTR InstName V_buck1
SYMATTR Value PWL(0 0 3m 0 5.7m 5)
SYMBOL voltage 3280 -576 R0
WINDOW 0 35 79 Left 2
WINDOW 3 -80 182 Left 2
WINDOW 123 0 0 Left 0
WINDOW 39 0 0 Left 0
SYMATTR InstName V_pgood1
SYMATTR Value PWL(0 0 13.999m 0 14m 3.3)
SYMBOL bv 3008 -928 R90
WINDOW 0 -32 56 VBottom 2
WINDOW 3 32 56 VTop 2
SYMATTR InstName B1
SYMATTR Value V=min(V(vin)-0.5, 4.4)
SYMBOL res 3472 -864 R90
WINDOW 0 0 56 VBottom 2
WINDOW 3 32 56 VTop 2
SYMATTR InstName R10
SYMATTR Value 10k
SYMBOL npn 3424 -624 R0
SYMATTR InstName Q4
SYMATTR Value 2N2222
SYMBOL res 3408 -592 R90
WINDOW 0 0 56 VBottom 2
WINDOW 3 32 56 VTop 2
SYMATTR InstName R27
SYMATTR Value 1k
SYMBOL bv 3136 -672 R90
WINDOW 0 -32 56 VBottom 2
WINDOW 3 32 56 VTop 2
SYMATTR InstName B2
SYMATTR Value V=min(V(v_node)-0.5, 3.3)
SYMBOL res 3520 -1072 R0
SYMATTR InstName R38
SYMATTR Value 1
SYMBOL cap 3696 -944 R90
WINDOW 0 0 32 VBottom 2
WINDOW 3 32 32 VTop 2
SYMATTR InstName C6
SYMATTR Value 100µ
TEXT 1224 -1136 Left 2 !.model FAULT_SW SW(Ron=10m Roff=1Meg Vt=2.5)
TEXT 280 816 Left 1 !.model SMAJ5_0A D(Is=1n Rs=0.064 Bv=6.4 Ibv=10m Cjo=2000p)
TEXT 2368 960 Left 2 ;Add button to drain the latch to break the loop and reset the latch without removing the battery
TEXT 944 512 Left 2 ;Get a integrated UVLO comparator for this, to prevent random triggering due to brownout situations\nOr put a zener with a 3.3V
TEXT 840 -1248 Left 2 !.model HEAVY_PMOS VDMOS(pchan Rg=2 Rd=5m Rs=2m Vto=-3.0 Kp=60 Cgdmax=3n Cgdmin=1n Cgs=5n Cjo=2n Is=20p mtriode=1 BV=55)
TEXT 944 480 Left 2 ;Maybe, give more time delay to this
TEXT 1224 -1200 Left 2 !.model LS_MOS SW(Ron=1.45m Roff=1Meg Vt=2.5 )\n.model HS_MOS SW(Ron=9.2m Roff=1Meg Vt=2.5 )
TEXT -1760 -312 Left 3 ;SCP/OCP trigger
TEXT -1856 -496 Left 3 ;Type III COmpensator
TEXT -1848 -1904 Left 3 ;Oscillator
TEXT -656 -920 Left 3 ;PWM Generator
TEXT -2104 720 Left 3 ;Over temperature Protection
TEXT 208 1488 Left 3 ;OVP Protection
TEXT 3024 344 Left 2 ;UVLO trigger
TEXT 2264 -1296 Left 3 ;Plant
TEXT 24 -840 Left 2 ;Final, masked PWM that\nwill be the gate driver input
TEXT -1696 -32 Left 2 ;INA181 current sense amp
TEXT 472 -32 Left 2 ;Various gpios required to turn leds \nfor visual debugging
TEXT -1784 1336 Left 3 ;INPUT_UVLO
TEXT 464 1488 Left 2 ;Latch may be triggered by OVP event\nor by the digital logic to handle prolonged\nSCP events
TEXT 168 -208 Left 2 ;checks if user used the button to drain latch
TEXT 1248 -152 Left 2 ;PGOOD (For secondary supply switching)
TEXT 80 -608 VRight 2 ;switch to buck output for IC supply
TEXT 2800 -240 Left 2 ;On pgood_en from supervisor, \nswitch housekeeping supply from HV LDO to buck itself.\nORing topology to ensure continuation of supply and no\ndip that may cause erratic bechaviour
TEXT -3584 -1224 Left 2 ;POWER SUPPLY SWITCHING
TEXT -2976 -712 Left 2 !.model PFET PMOS(Vto=-1.5 Kp=50 W=0.1 L=1u Rd=0.05 Rs=0.01)
TEXT 2808 -1280 Left 2 ;POWER SUPPLY SWITCHING
TEXT 3360 -776 Left 2 !.model PFET PMOS(Vto=-1.5 Kp=50 W=0.1 L=1u Rd=0.05 Rs=0.01)
RECTANGLE Normal -688 -512 -1856 -1008 2
RECTANGLE Normal -800 -1072 -1856 -1872 2
RECTANGLE Normal -176 -944 -656 -1232 2
RECTANGLE Normal 3168 1456 208 384 2
RECTANGLE Normal -1024 1312 -1792 816 2
RECTANGLE Normal 2416 -1280 672 -256 2
RECTANGLE Normal -1024 16 -1760 -288 2
RECTANGLE Normal -1024 784 -2208 48 2
RECTANGLE Normal 2064 272 1248 -128 2
RECTANGLE Normal -2160 -208 -3584 -1168 2
RECTANGLE Normal 4224 -272 2800 -1232 2

The netlist it stands for:
* digital_architecture.asc
C1 Vout 0 27.77µ V=25 Rser=2.94m Lser=0.6n
L1 switch_node Vout 5.6µ Rser=1m
V1 N019 0 2.5
Rf1 Vout N009 7.91k
Rf2 N018 N009 50
Cf1 Vout N018 10n
Rc1 N016 N009 2.99k
Cc1 comp_out N009 237p
Rf3 N009 0 7.91k
V2 P001 0 5
Cc2 comp_out N016 26.6n
C2 Vout 0 27.77µ V=25 Rser=2.94m Lser=0.6n
C3 Vout 0 27.77µ V=25 Rser=2.94m Lser=0.6n
X§U1 comp_out V_trig N006 0 Master_PWM tlv3501  ; pins In+ In- V+ V- OUT
V3 N006 0 5
S1 switch_node N015 NC_01 0 HS_MOS
V4 Battery_in 0 22
V5 P002 0 5
V6 N002 0 5
R1 V_trig N005 8k
R2 N005 V_comp 10k
R3 N001 V_comp 6.944k
C4 V_trig N001 100p
Vref_comp1 N004 0 2.5
Vref_int1 N003 0 2.5
X§U2 N003 N001 N002 0 V_trig OPA365  ; pins In+ In- V+ V- OUT
X§U3 N005 N004 P002 0 V_comp tlv3501  ; pins In+ In- V+ V- OUT
X§U4 N019 N009 P001 0 comp_out OPA365  ; pins In+ In- V+ V- OUT
S2 V_sense switch_node NC_02 0 LS_MOS
D2 0 switch_node BAT54
D3 comp_out N009 D
R6 V_sense 0 5m
X§U5 N026 V_sense P003 0 N025 tlv3501  ; pins In+ In- V+ V- OUT
V7 P003 0 5
M2 Battery_in PMOS_gate PMOS_source PMOS_source HEAVY_PMOS
R11 PMOS_gate 0 100k
D6 PMOS_gate PMOS_source BZX84C12L
R12 N031 V_temp_sense R=10k * exp(3950 * (1/(V(T_node)+273.15) - 1/298.15))
R13 V_temp_sense 0 10k
V12 N031 0 5
X§U7 N033 V_temp_sense N032 0 N027 tlv3501  ; pins In+ In- V+ V- OUT
V13 N032 0 5
R14 N033 N031 10k
R15 0 N033 136.1k
R16 N027 N033 186.8k
X§U8 V_v+ N038 N036 0 N040 tlv3501  ; pins In+ In- V+ V- OUT
V15 N036 0 PWL(0 0 1m 5 6m 5 6.001m 0 7m 0)
V16 N038 0 2.5
Q1 N034 npn_base 0 0 2N3904
Q2 N045 N035 PMOS_source 0 2N3906
R17 N035 N034 4.7k
R18 npn_base N041 4.7k
D7 OVP_out N041 BAT54
R19 N044 N045 4.7k
D8 N045 PMOS_gate 1N5819
R20 PMOS_source N035 10k
D9 P004 Vout SMAJ5_0A
R21 V_v+ Vout 12K
R22 V_v+ 0 10K
C8 V_v+ 0 1n
C9 npn_base 0 10n
R23 PMOS_source N034 10k
D10 N044 npn_base D
R24 npn_base 0 10k
Q3 OVP_out N047 0 0 2N3904
C10 N046 N036 100n Rser=0.1
R25 N047 0 100k
R26 N047 N046 1k
R28 OVP_out N040 1k
M3 N015 PMOS_gate PMOS_source PMOS_source HEAVY_PMOS
R29 0 P004 5m
C11 N015 0 47µ Rser=0.05
X§U9 N043 N039 N037 0 N042 tlv3501  ; pins In+ In- V+ V- OUT
V18 N037 0 5
R30 N043 Battery_in 10k
R31 0 N043 3.086k
R32 N043 N042 83.3k
V19 N039 0 2.5
R34 Vout 0 50
Coss1 switch_node V_sense 1.68n
coss_HS1 switch_node N015 450p
C12 N024 0 6.8n
R36 switch_node N024 2.2
X§X1 NC_03 PGOOD_comp External_crystal_osc Master_PWM N025 OVP_out N027 N028 to_gate_driver_enable Digital_trigger latch_stat To_gate_driver_PWM_in Fault_Leds To_External_MCU To_External_MCU NC_04 CPLD_super  ; pins G_En PGOOD Clk_Ext Osc_in CP_trig OVP_trig OTP_trig UVLO_trig En latch_out latch_stat PWM_out Fault_LED I2C_SDA I2C_SCL Supply_switch
R4 latch_stat N045 10k
D1 0 latch_stat 1N750
D4 0 N028 1N750
R5 N028 N042 10k
D5 Digital_trigger N041 BAT54
X§U6 N030 N029 P005 0 PGOOD_comp tlv3501  ; pins In+ In- V+ V- OUT
V8 N029 0 1.65
R7 N030 Vout 10k
R8 0 N030 5.41k
R9 PGOOD_comp N030 165k
V9 P005 0 3.3
M4 N013 N017 v_node v_node PFET
D12 N012 v_node 1N5819
V_bat2 vin 0 PWL(0 0 1m 22)
V_buck2 N008 0 PWL(0 0 3m 0 5.7m 5)
V_pgood2 N022 0 PWL(0 0 13.999m 0 14m 3.3)
B3 N012 0 V=min(V(vin)-0.5, 4.4)
R33 N017 v_node 10k
Q5 N017 N023 0 0 2N2222
R35 N023 N022 1k
B4 v_out 0 V=min(V(v_node)-0.5, 3.3)
R37 N008 N013 1
C5 0 N013 100µ
M1 N011 N014 v_node v_node PFET
D11 N010 v_node 1N5819
V_bat1 vin 0 PWL(0 0 1m 22)
V_buck1 N007 0 PWL(0 0 3m 0 5.7m 5)
V_pgood1 N020 0 PWL(0 0 13.999m 0 14m 3.3)
B1 N010 0 V=min(V(vin)-0.5, 4.4)
R10 N014 v_node 10k
Q4 N014 N021 0 0 2N2222
R27 N021 N020 1k
B2 v_out 0 V=min(V(v_node)-0.5, 3.3)
R38 N007 N011 1
C6 0 N011 100µ
.model D D
.lib standard.dio
.model NPN NPN
.model PNP PNP
.lib standard.bjt
.model NMOS NMOS
.model PMOS PMOS
.lib standard.mos
.model FAULT_SW SW(Ron=10m Roff=1Meg Vt=2.5)
.model SMAJ5_0A D(Is=1n Rs=0.064 Bv=6.4 Ibv=10m Cjo=2000p)
* Add button to drain the latch to break the loop and reset the latch without removing the battery
* Get a integrated UVLO comparator for this, to prevent random triggering due to brownout situations
* Or put a zener with a 3.3V
.model HEAVY_PMOS VDMOS(pchan Rg=2 Rd=5m Rs=2m Vto=-3.0 Kp=60 Cgdmax=3n Cgdmin=1n Cgs=5n Cjo=2n Is=20p mtriode=1 BV=55)
* Maybe, give more time delay to this
.model LS_MOS SW(Ron=1.45m Roff=1Meg Vt=2.5 )
.model HS_MOS SW(Ron=9.2m Roff=1Meg Vt=2.5 )
* SCP/OCP trigger
* Type III COmpensator
* Oscillator
* PWM Generator
* Over temperature Protection
* OVP Protection
* UVLO trigger
* Plant
* Final, masked PWM that
* will be the gate driver input
* INA181 current sense amp
* Various gpios required to turn leds
* for visual debugging
* INPUT_UVLO
* Latch may be triggered by OVP event
* or by the digital logic to handle prolonged
* SCP events
* checks if user used the button to drain latch
* PGOOD (For secondary supply switching)
* switch to buck output for IC supply
* On pgood_en from supervisor,
* switch housekeeping supply from HV LDO to buck itself.
* ORing topology to ensure continuation of supply and no
* dip that may cause erratic bechaviour
* POWER SUPPLY SWITCHING
.model PFET PMOS(Vto=-1.5 Kp=50 W=0.1 L=1u Rd=0.05 Rs=0.01)
* POWER SUPPLY SWITCHING
.model PFET PMOS(Vto=-1.5 Kp=50 W=0.1 L=1u Rd=0.05 Rs=0.01)
.backanno
.end